# Altium schematic sheet 海关全向本体电路板V3_Mpu6050模块.SchDoc
size A4
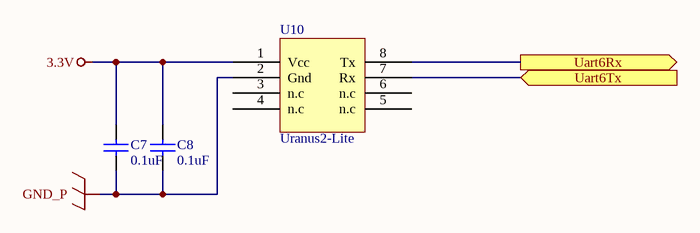
[diagram p0: 海关全向本体电路板V3_Mpu6050模块.SchDoc]

## Parts
C7  0.1uF  [C0603-S]
C8  0.1uF  [C0603-S]
U10  Uranus2-Lite  [Uranus2-Lite]

## Ports
Uart6Rx (out), Uart6Tx (in)

## Nets
3.3V: C7.2 C8.2 U10.1(Vcc)
GND_P: C7.1 C8.1 U10.2(Gnd)
Uart6Rx: U10.8(Tx) ; port Uart6Rx
Uart6Tx: U10.7(Rx) ; port Uart6Tx

Not connected (* = marked no-connect by the designer): U10 3(n.c) 4(n.c) 5(n.c) 6(n.c)

## Library data of the parts
C7 C8 = CAP: Published: 8-Jun-2000; LatestRevisionDate: 17-Jul-2002; LatestRevisionNote: Re-released for DXP Platform.; PackageReference: RAD-0.3; Publisher: Altium Limited; Value: 0.1uF